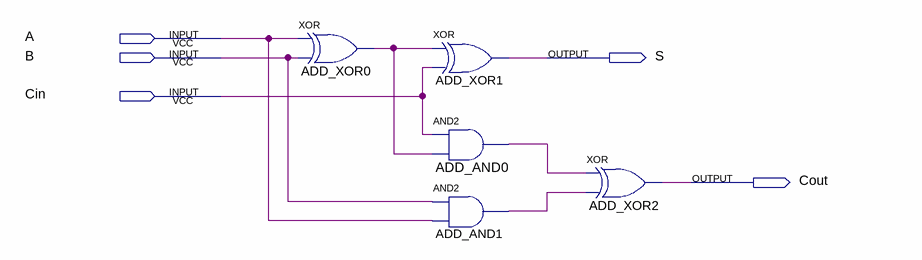
[diagram p0: schematic sheet]
// Quartus schematic fullAdder.bdf as structural Verilog: 5 symbols, 5 pins
module fullAdder (
  input  A,
  input  B,
  input  Cin,
  output S,
  output Cout
);

  wire ADD_AND0_out, ADD_AND1_out, ADD_XOR0_out;

  xor ADD_XOR0 (ADD_XOR0_out, A, B);
  xor ADD_XOR1 (S, ADD_XOR0_out, Cin);
  and ADD_AND0 (ADD_AND0_out, Cin, ADD_XOR0_out);
  and ADD_AND1 (ADD_AND1_out, B, A);
  xor ADD_XOR2 (Cout, ADD_AND0_out, ADD_AND1_out);
endmodule
